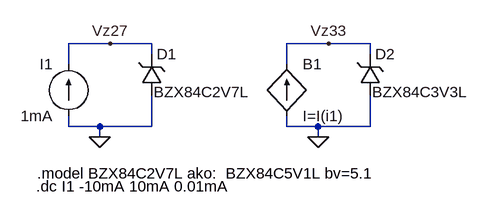
[diagram p0: schematic zener.asc]
zener.asc, the LTspice schematic file:
Version 4
SHEET 1 880 680
WIRE 112 112 48 112
WIRE 176 112 112 112
WIRE 448 112 384 112
WIRE 512 112 448 112
WIRE 176 128 176 112
WIRE 512 128 512 112
WIRE 48 144 48 112
WIRE 384 144 384 112
WIRE 48 240 48 224
WIRE 96 240 48 240
WIRE 176 240 176 192
WIRE 176 240 96 240
WIRE 384 240 384 224
WIRE 432 240 384 240
WIRE 512 240 512 192
WIRE 512 240 432 240
WIRE 96 256 96 240
WIRE 432 256 432 240
FLAG 96 256 0
FLAG 112 112 Vz27
FLAG 448 112 Vz33
FLAG 432 256 0
SYMBOL current 48 224 R180
WINDOW 0 24 80 Left 2
WINDOW 3 24 0 Left 2
WINDOW 123 0 0 Left 2
WINDOW 39 0 0 Left 2
SYMATTR InstName I1
SYMATTR Value 1mA
SYMBOL zener 160 192 M180
WINDOW 0 24 64 Left 2
WINDOW 3 19 5 Left 2
SYMATTR InstName D1
SYMATTR Value BZX84C2V7L
SYMATTR Description Diode
SYMATTR Type diode
SYMBOL zener 496 192 M180
WINDOW 0 24 64 Left 2
WINDOW 3 19 5 Left 2
SYMATTR InstName D2
SYMATTR Value BZX84C3V3L
SYMATTR Description Diode
SYMATTR Type diode
SYMBOL bi2 384 144 R0
SYMATTR InstName B1
SYMATTR Value I=I(i1)
TEXT 0 312 Left 2 !.model BZX84C2V7L ako:  BZX84C5V1L bv=5.1
TEXT -2 332 Left 2 !.dc I1 -10mA 10mA 0.01mA

The netlist it stands for:
* zener.asc
I1 0 Vz27 1mA
D1 0 Vz27 BZX84C2V7L
D2 0 Vz33 BZX84C3V3L
B1 0 Vz33 I=I(i1)
.model D D
.lib standard.dio
.model BZX84C2V7L ako:  BZX84C5V1L bv=5.1
.dc I1 -10mA 10mA 0.01mA
.backanno
.end